# EAGLE design 8LEDs (EAGLE 6.5.0)
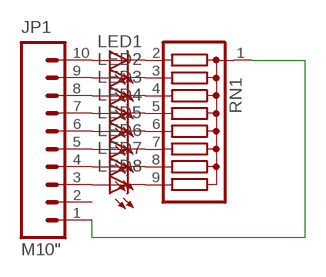
[diagram p0: schematic, sheet 1]

## Parts
JP1  M10"  [1X10]
LED1  LED5MM  [LED5MM]
LED2  LED5MM  [LED5MM]
LED3  LED5MM  [LED5MM]
LED4  LED5MM  [LED5MM]
LED5  LED5MM  [LED5MM]
LED6  LED5MM  [LED5MM]
LED7  LED5MM  [LED5MM]
LED8  LED5MM  [LED5MM]
RN1  G08R  [SIL9]

## Nets
GND: JP1.1 RN1.1
N$1: LED1.K(C) RN1.2
N$2: LED2.K(C) RN1.3
N$3: LED3.K(C) RN1.4
N$4: LED4.K(C) RN1.5
N$5: LED5.K(C) RN1.6
N$6: LED6.K(C) RN1.7
N$7: LED7.K(C) RN1.8
N$8: LED8.K(C) RN1.9
N$9: JP1.10 LED1.A
N$10: JP1.9 LED2.A
N$11: JP1.8 LED3.A
N$12: JP1.7 LED4.A
N$13: JP1.6 LED5.A
N$14: JP1.5 LED6.A
N$15: JP1.4 LED7.A
N$16: JP1.3 LED8.A
Unconnected: JP1.2

## Library data of the parts
JP1 = SparkFun-Connectors:M10: Header 10 Standard 10-pin 0.1" header. Use with straight break away headers (SKU : PRT-00116), right angle break away headers (PRT-00553), swiss pins (PRT-00743), machine pins (PRT-00117), and female headers (PRT-00115).
LED1-LED8 = SparkFun-LED:LED: LEDs Standard schematic elements and footprints for 5mm, 3mm, 1206, and 0603 sized LEDs. 5mm - Spark Fun Electronics SKU : COM-00529 (and others)
RN1 = resistor-sil:G08R: SIL RESISTOR; OC_FARNELL: unknown; OC_NEWARK: unknown

## Board
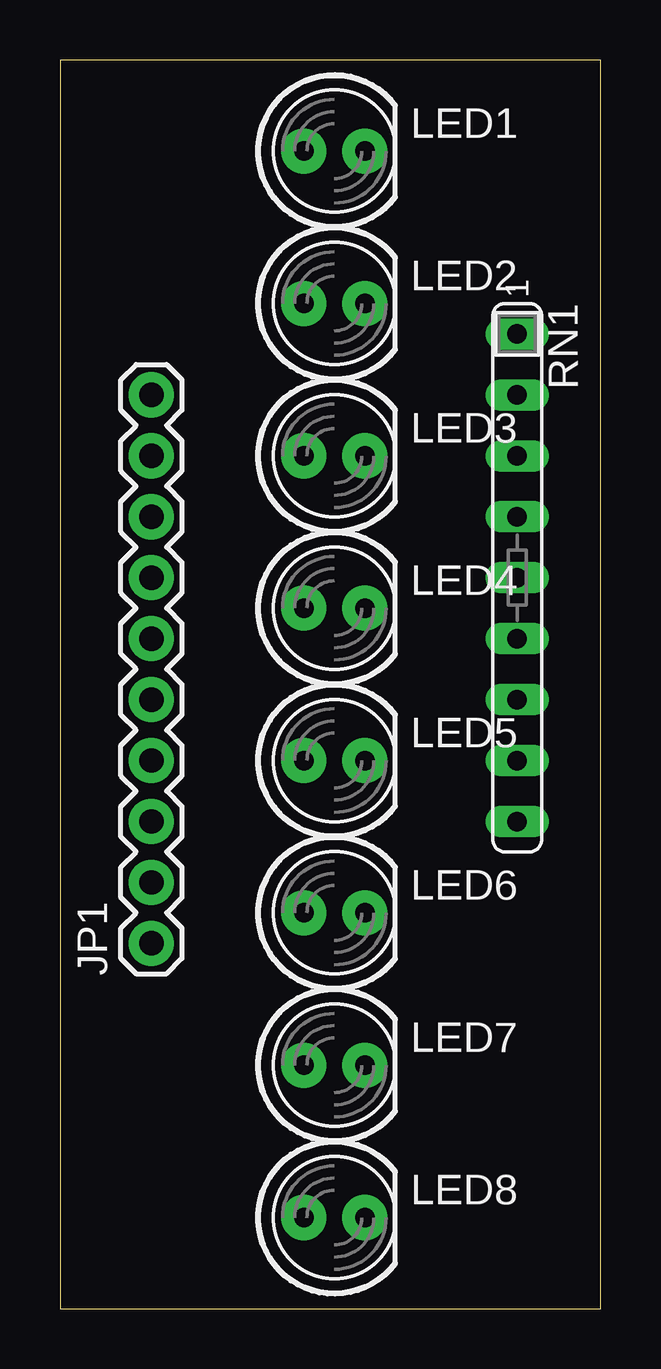
[diagram p1: board, top side]
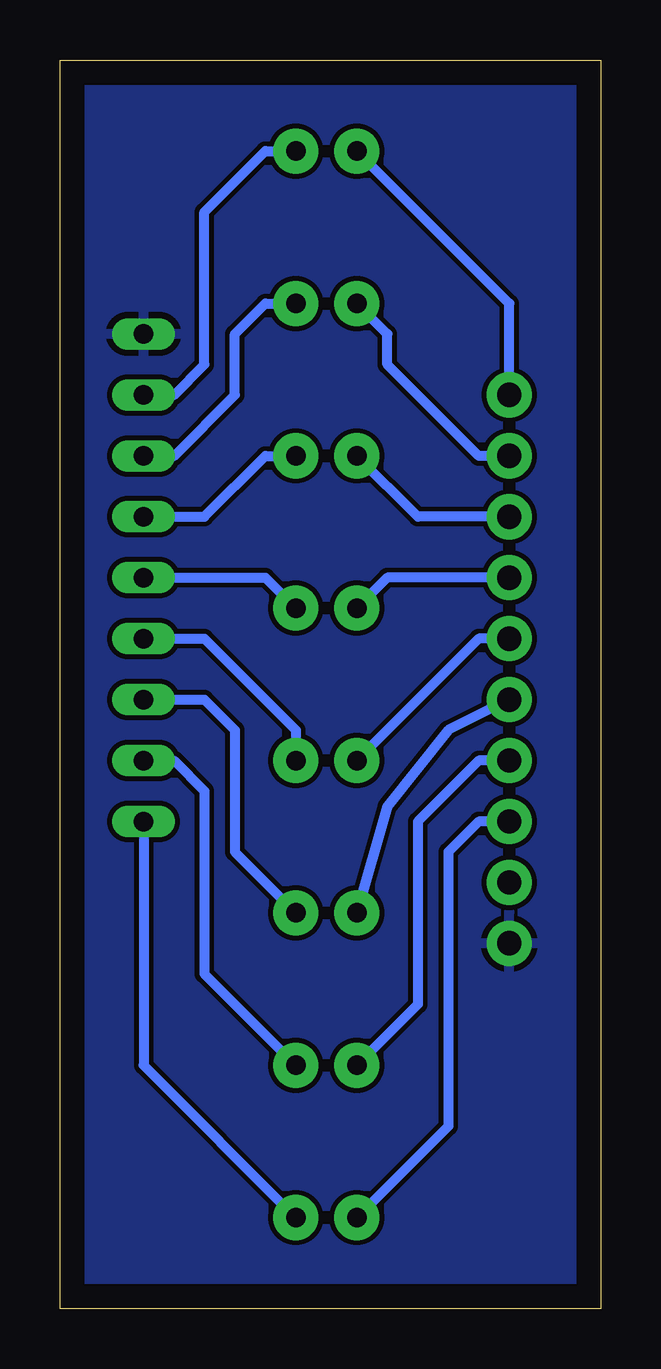
[diagram p2: board, bottom side, seen from below]

Size 22.53 x 52.06 mm. Coordinates in mm from the lower left corner, seen from the top.
Outline: 0,0 22.53,0 22.53,52.06 0,52.06 0,0
Copper layers (1*16): Top 0.035mm / dielectric 1.5mm / Bottom 0.035mm
Design rules "default": minimum track width 10mil, minimum drill 24mil, track to track 8mil, track to pad 8mil, pad to pad 8mil, via to via 8mil, smd to smd 8mil, copper to edge 40mil, drill to drill 8mil, minimum pad ring 10mil, minimum via ring 8mil, stop-mask expansion 4mil, vias tented up to drill 0mil, thermal gap 10mil

### Footprints (pad centres in the part's own frame; a part is rotated, then mirrored left to right if it is on the bottom)
1X10 = drill 1.016 pad 1.88: 1 0,0; 2 2.54,0; 3 5.08,0; 4 7.62,0; 5 10.16,0; 6 12.7,0; 7 15.24,0; 8 17.78,0; 9 20.32,0; 10 22.86,0
LED5MM = drill 0.813 pad 1.88: A -1.27,0; K 1.27,0
SIL9 = drill 0.813 long: 1 -10.16,0; 2 -7.62,0; 3 -5.08,0; 4 -2.54,0; 5 0,0; 6 2.54,0; 7 5.08,0; 8 7.62,0; 9 10.16,0

### Placement (x,y rotation side)
JP1  3.81,15.24 90 top
LED1  11.43,48.26 0 top
LED2  11.43,41.91 0 top
LED3  11.43,35.56 0 top
LED4  11.43,29.21 0 top
LED5  11.43,22.86 0 top
LED6  11.43,16.51 0 top
LED7  11.43,10.16 0 top
LED8  11.43,3.81 0 top
RN1  19.05,30.48 270 top

### Tracks (layer width: path | path; a pad name or v marks a point on that pad's centre or on a via)
GND
  pour Bottom: 0,52.07 0,0 22.86,0 22.86,52.07
N$1
  Bottom 0.406: RN1.2 17.78,38.1 16.51,39.37 16.51,45.72 13.97,48.26 LED1.K
N$2
  Bottom 0.406: RN1.3 17.78,35.56 15.24,38.1 15.24,40.64 13.97,41.91 LED2.K
N$3
  Bottom 0.406: RN1.4 16.51,33.02 13.97,35.56 LED3.K
N$4
  Bottom 0.406: RN1.5 13.97,30.48 LED4.K
N$5
  Bottom 0.406: RN1.6 16.51,27.94 12.7,24.13 LED5.K
N$6
  Bottom 0.406: RN1.7 16.51,25.4 15.24,24.13 15.24,19.05 LED6.K
N$7
  Bottom 0.406: LED7.K 16.51,13.97 16.51,21.59 17.78,22.86 RN1.8
N$8
  Bottom 0.406: RN1.9 19.05,10.16 LED8.K
N$9
  Bottom 0.406: JP1.10 3.81,41.91 LED1.A
N$10
  Bottom 0.406: JP1.9 5.08,35.56 8.89,39.37 8.89,40.64 LED2.A
N$11
  Bottom 0.406: JP1.8 7.62,33.02 LED3.A
N$12
  Bottom 0.406: JP1.7 8.89,30.48 LED4.A
N$13
  Bottom 0.406: JP1.6 5.08,27.94 LED5.A
N$14
  Bottom 0.406: JP1.5 6.35,24.13 8.89,20.95 LED6.A
N$15
  Bottom 0.406: JP1.4 5.08,22.86 7.62,20.32 7.62,12.7 LED7.A
N$16
  Bottom 0.406: JP1.3 5.08,20.32 6.35,19.05 6.35,7.62 LED8.A